# EAGLE design GDEnvSensorNode_1_4d (EAGLE 9.0.1)
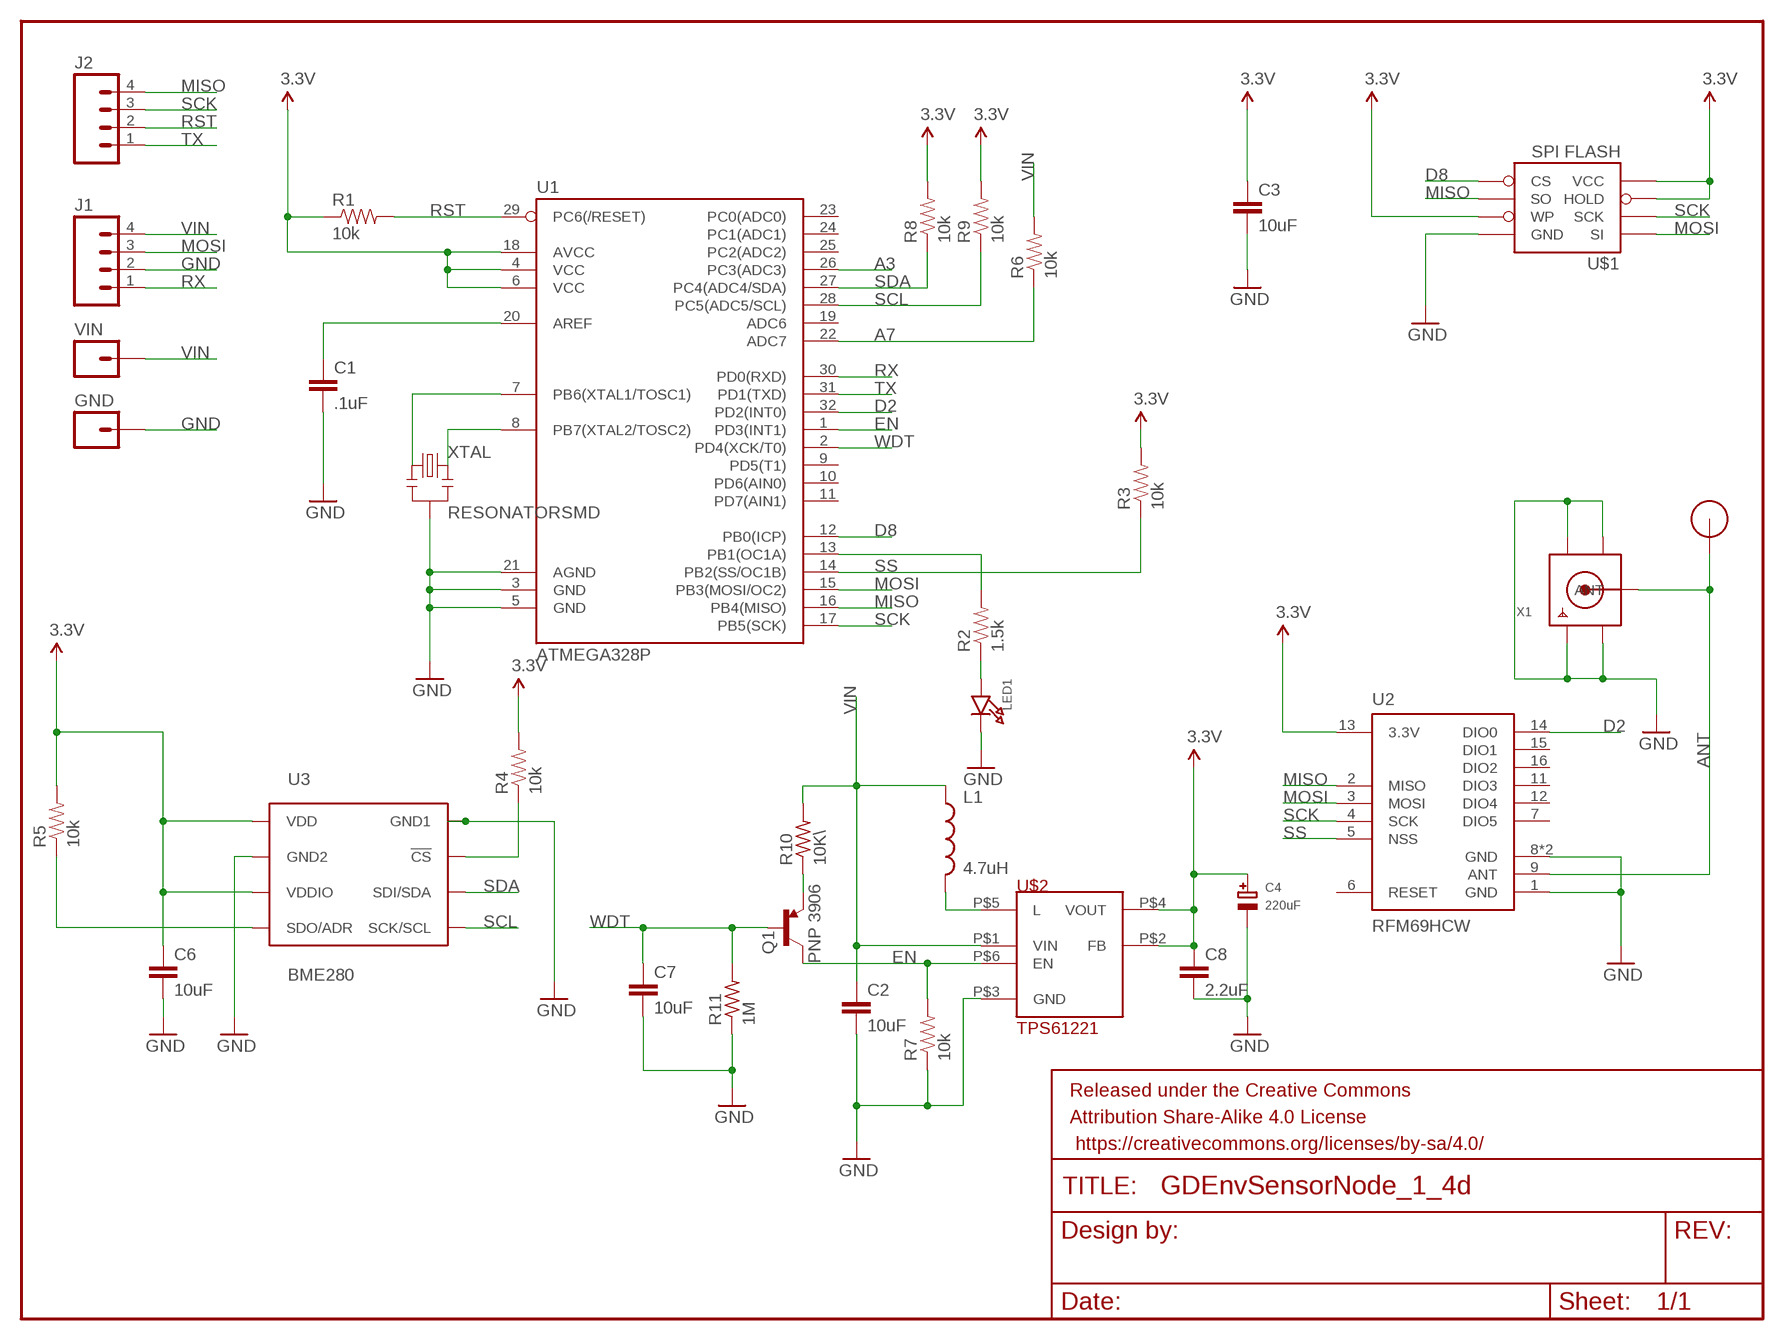
[diagram p0: schematic, sheet 1]

## Parts
C1  .1uF  CAP0805  [0805]
C2  10uF  CAP0805  [0805]
C3  10uF  CAP0805  [0805]
C4  220uF  CAP_TANTALUMB/3528_REFLOW  [EIA3528-21/B-R]
C6  10uF  CAP0805  [0805]
C7  10uF  CAP0805  [0805]
C8  2.2uF  CAP0805  [0805]
FRAME1  FRAME-LETTER  [CREATIVE_COMMONS]
GND  M01PTH_2MM  [1X01_2MM]
J1  M04PTH  [1X04]
J2  M04PTH  [1X04]
L1  4.7uH  INDUCTOR1210  [1210]
LED1  LED0805  [CHIPLED_0805]
Q1  PNP 3906  TRANSISTOR_PNPPMBT3906  [SOT23-3]
R1  10k  RESISTOR0805-RES  [0805]
R2  1.5k  RESISTOR0805-RES  [0805]
R3  10k  RESISTOR0805-RES  [0805]
R4  10k  RESISTOR0805-RES  [0805]
R5  10k  RESISTOR0805-RES  [0805]
R6  10k  RESISTOR0805-RES  [0805]
R7  10k  RESISTOR0805-RES  [0805]
R8  10k  RESISTOR0805-RES  [0805]
R9  10k  RESISTOR0805-RES  [0805]
R10  10K\  R-US_R0805  [R0805]
R11  1M  R-US_R0805  [R0805]
U1  ATMEGA328P  ATMEGA328P_TQFP  [TQFP32-08]
U2  RFM69HCW  [RFM69HCW-XXXS2]
U3  BME280  [BME280_LGA]
U$1  SPI FLASH  AT25F512BJEDEC_3.9MM  [SO08]
U$2  TPS61221  [TPS61221]
U$4  RFM12B_ANTENNA  [RFM12B-ANTENNA]
VIN  M01PTH_2MM  [1X01_2MM]
X1  SMACONNECTOR_EDGE_UFL  [SMA_EDGELAUNCH_UFL]
XTAL  RESONATORSMD  [RESONATOR-SMD]

## Nets
3.3V: C3.1 C4.+ C6.1 C8.1 R1.1 R3.2 R4.2 R5.2 R8.2 R9.2 U1.4(VCC) U1.6(VCC) U1.18(AVCC) U2.13(3.3V) U3.P$6(VDDIO) U3.P$8(VDD) U$1.3_WP(WP) U$1.7_HOLD(HOLD) U$1.8_VCC(VCC) U$2.P$2(FB) U$2.P$4(VOUT)
A3: U1.26(PC3(ADC3))
A7: R6.1 U1.22(ADC7)
ANT: U2.9(ANT) U$4.P$1 X1.P(ANT)
D2: U1.32(PD2(INT0)) U2.14(DIO0)
D8: U1.12(PB0(ICP)) U$1.1_CS(CS)
EN: Q1.3(C) R7.2 U1.1(PD3(INT1)) U$2.P$6(EN)
GND: C1.2 C2.2 C3.2 C4.- C6.2 C7.2 C8.2 GND.1 J1.2 LED1.C R7.1 R11.1 U1.3(GND) U1.5(GND) U1.21(AGND) U2.1(GND) U2.8(GND) U2.10(GND) U3.P$1(GND1) U3.P$7(GND2) U$1.4_GND(GND) U$2.P$3(GND) X1.GND@1(GND1) X1.GND@2(GND2) X1.GND@3(GND3) X1.GND@4(GND4) XTAL.2
L: L1.2 U$2.P$5(L)
MISO: J2.4 U1.16(PB4(MISO)) U2.2(MISO) U$1.2_SO(SO)
MOSI: J1.3 U1.15(PB3(MOSI/OC2)) U2.3(MOSI) U$1.5_SI(SI)
N$1: U1.8(PB7(XTAL2/TOSC2)) XTAL.3
N$2: U1.7(PB6(XTAL1/TOSC1)) XTAL.1
N$3: LED1.A R2.1
N$4: Q1.2(E) R10.1
N$5: R4.1 U3.P$2(!CS)
N$8: R2.2 U1.13(PB1(OC1A))
N$13: C1.1 U1.20(AREF)
N$17: R5.1 U3.P$5(SDO/ADR)
RST: J2.2 R1.2 U1.29(PC6(/RESET))
RX: J1.1 U1.30(PD0(RXD))
SCK: J2.3 U1.17(PB5(SCK)) U2.4(SCK) U$1.6_SCK(SCK)
SCL: R9.1 U1.28(PC5(ADC5/SCL)) U3.P$4(SCK/SCL)
SDA: R8.1 U1.27(PC4(ADC4/SDA)) U3.P$3(SDI/SDA)
SS: R3.1 U1.14(PB2(SS/OC1B)) U2.5(NSS)
TX: J2.1 U1.31(PD1(TXD))
VIN: C2.1 J1.4 L1.1 R6.2 R10.2 U$2.P$1(VIN) VIN.1
WDT: C7.1 Q1.1(B) R11.2 U1.2(PD4(XCK/T0))
Unconnected: U1.9(PD5(T1)) U1.10(PD6(AIN0)) U1.11(PD7(AIN1)) U1.19(ADC6) U1.23(PC0(ADC0)) U1.24(PC1(ADC1)) U1.25(PC2(ADC2)) U2.6(RESET) U2.7(DIO5) U2.11(DIO3) U2.12(DIO4) U2.15(DIO1) U2.16(DIO2)

## Library data of the parts
C1-C3 C6-C8 = SparkFun-Capacitors:CAP: Capacitor Standard 0603 ceramic capacitor, and 0.1" leaded capacitor.
C4 = microbuilder:CAP_TANTALUM: Tantalum Capacitors Wave footprints have larger pads and are meant to be used for hand soldering. Reflow footprints are optimised for solder paste and a reflow oven. EIA3216-18/A-[R/W] - Size A / 3216-18 / 1206 footprint 4.7µF 25V 10% Tantalum Capacitor 10µF 16V 10% Tantalum Capacitor [Digikey: 495-2236-2-ND] EIA3528-21/B-[R/W] - Size B / 3528-21 47µF 10V 10% Tantalum Capactior [Digikey: 495-2216-1-ND] EIA6032-28/C-[R/W] - Size C / 6032-28 10µF 35V 20% Tantalum Capacitor [Digikey: 495-2285-1-ND] 100µF 16V 10% Tantalum Capactior [Digikey: 399-5214-1-ND]
FRAME1 = SparkFun-Aesthetics:FRAME-LETTER: Schematic Frame Standard 8.5x11 US Letter frame
GND VIN = SparkFun-Connectors:M01: Header 1 Standard 1-pin 0.1" header. Use with straight break away headers (SKU : PRT-00116), right angle break away headers (PRT-00553), swiss pins (PRT-00743), machine pins (PRT-00117), and female headers (PRT-00115). SMTSO-256-ET is a "flush mount" nut for a 4-40 screw. The older package used to be too tight, and did not allow it to sit properly thru the drill hit. The latest (0.165DIA) fits nice and snug.
J1 J2 = SparkFun-Connectors:M04: Header 4 Standard 4-pin 0.1" header. Use with straight break away headers (SKU : PRT-00116), right angle break away headers (PRT-00553), swiss pins (PRT-00743), machine pins (PRT-00117), and female headers (PRT-00115). Molex polarized connector foot print use with SKU : PRT-08231 with associated crimp pins and housings. 1MM SMD Version SKU: PRT-10208; PROD_ID: CONN-09696
L1 = SparkFun-Passives:INDUCTOR: Inductors Basic Inductor/Choke - 0603 and 1206. Footprints are not proven and vary greatly between part numbers. INDUCTOR POWER 3.3UH 4.0A SMD 0.197" L x 0.197" W x 0.177" H (5.00mm x 5.00mm x 4.50mm)
LED1 = microbuilder:LED: LED 0603 - 0603 Surface Mount Package 2mA: Green LED - Low Power (3.9mcd, 2ma, 1.7Vf) - Digikey: 475-2709-2-ND Orange LED - Low Power (9.8mcd, 2ma, 1.8Vf) - Digikey: 475-1194-2-ND Red LED - Low Power (5mcd, 2ma, 1.8Vf) - Digikey: 475-1195-2-ND Yellow LED - Low Power (7mcd, 2ma, 1.8Vf) - Digikey: 475-1196-2-ND 5mA: Blue LED - Low Power (17mcd, 5ma, 2.9Vf) - Digikey: LNJ937W8CRACT-ND 0805 - 0805 Surface Mount Package 2mA: Red LED (8.8mcd, 2mA, 1.8Vf, Clear) - Low Power [Digikey: 475-2510-1-ND] Green LED (5mcd, 2mA, 1.8Vf, Clear) - Low Power [Digikey: 475-2730-1-ND] Yellow LED (11.3mcd, 2mA, 1.8Vf, Clear) - Low Power [Digikey: 475-2555-1-ND] 20mA: Red LED (104mcd, 20mA, Diffused) - LS R976 [Digikey: 475-1278-6-ND] Red LED (12mcd, 20mA, 2.0Vf, Clear) - APT2012EC [Digikey: 754-1128-1-ND] Green LED (15mcd, 20mA, 2.2Vf, Clear) - APT2012GC [Digikey: 754-1131-1-ND] Orange LED (160mcd, 20mA, 2.1Vf, Clear) - APT2012SECK [Digikey: 754-1130-1-ND] 1206 - 1206 Surface Mount Package Green LED (26mcd, 20mA, Diffused) - LG N971 [Digikey: 475-1407-6-ND] Red LED (15mcd, 20mA, Diffused) - LH N974 [Digikey: 475-1416-6-ND]
Q1 = SparkFun-DiscreteSemi:TRANSISTOR_PNP: Generic PNP BJT Double check pinouts against datasheets- not all devices are the same! MMBT3906 - 40V 200mA SOT-23 (TRANS-08052) MMBT4403 - 40V 600mA SOT-23 (TRANS-09245); PROD_ID: TRANS-08052; VALUE: PMBT3906
R1-R9 = SparkFun-Passives:RESISTOR: Resistor Basic schematic elements and footprints for 0603, 1206, and PTH resistors.
R10 R11 = adafruit:R-US_: RESISTOR, American symbol
U1 = SparkFun-DigitalIC:ATMEGA328P_TQFP; PROD_ID: IC-09069; VALUE: ATMEGA328P_TQFP
U2 = SparkFun-RF:RFM69H; PROD_ID: IC-11997, IC-12053
U3 = BME280ComponentLibrary:BME280; PROD_ID: IC-13090
U$1 = LowPowerLab:AT25F512B: 4-Mbit SPI flash memory
U$2 = GDTech:TPS61221; AVAILABILITY: Unavailable; DESCRIPTION: the tps6122x family devices provide a power-supply solution for products powered by either a single-cell two-cell or ...; MF: Texas Instruments; MP: TPS61221; PACKAGE: SC-70 Texas Instruments; PRICE: None
U$4 = LowPowerLab:RFM12B_ANTENNA
X1 = adafruit:SMACONNECTOR: SMA Connector 90° DIP SMA Connector, 50 Ohm (4UConnector: 07259)
XTAL = GDTech:RESONATOR: Resonator Small SMD resonator. This is the itty bitty 10/20MHz resonators with built in caps. CSTCE10M0G55 and CSTCE20M0V53. Footprint has been reviewed closely but hasn't been tested yet.

## Board
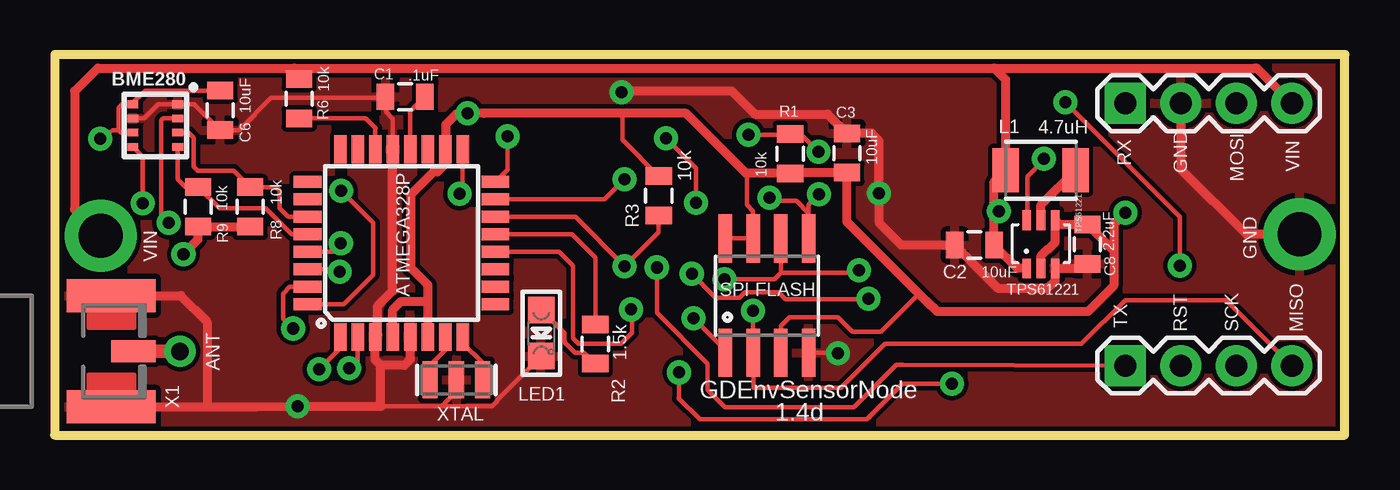
[diagram p1: board, top side]
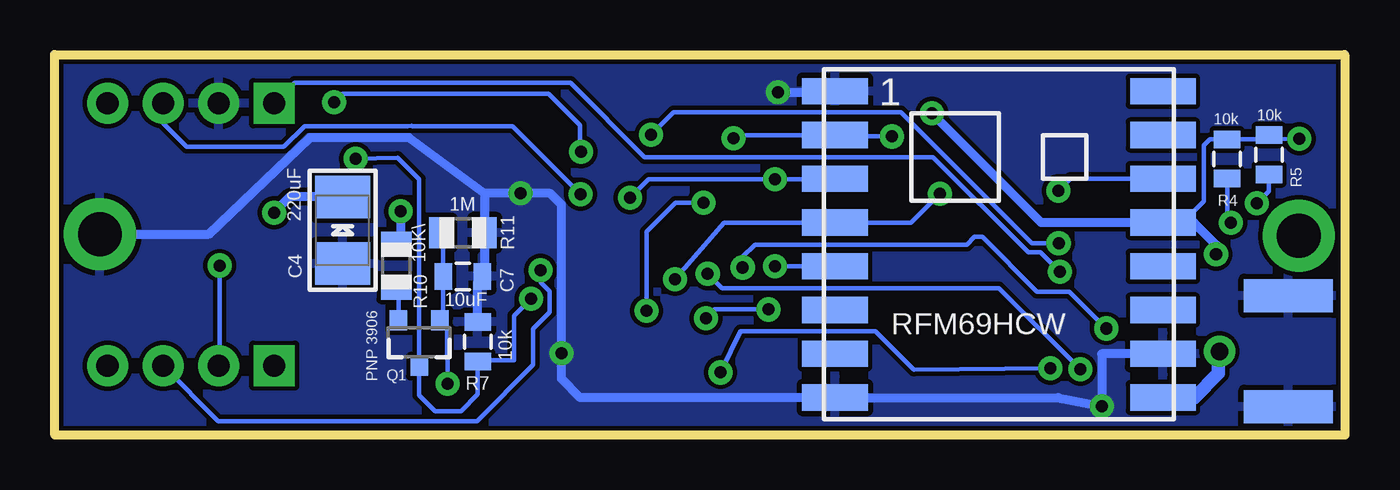
[diagram p2: board, bottom side, seen from below]

Size 59.01 x 17.4 mm. Coordinates in mm from the lower left corner, seen from the top.
Outline: 0,0 59,0 59.01,17.4 0.01,17.4 0,0
Copper layers (1*16): Top 0.035mm / dielectric 1.5mm / Bottom 0.035mm
Design rules "SparkFun *": minimum track width 8mil, minimum drill 20mil, track to track 8mil, track to pad 8mil, pad to pad 8mil, via to via 8mil, smd to smd 8mil, copper to edge 8mil, drill to drill 8mil, minimum pad ring 12mil, minimum via ring 10mil, stop-mask expansion 4mil, vias tented up to drill 22mil, thermal gap 10mil

### Footprints (pad centres in the part's own frame; a part is rotated, then mirrored left to right if it is on the bottom)
0805 = smd 0.8 x 1.2: 1 -0.9,0; 2 0.9,0
EIA3528-21/B-R = smd 1.95 x 2.5: + 1.525,0; - -1.525,0
1X01_2MM = drill 2 pad 3.302: 1 0,0
1X04 = drill 1.016 pad 1.88 square: 1 0,0 | drill 1.016 pad 1.88: 2 2.54,0; 3 5.08,0; 4 7.62,0
1210 = smd 1.2 x 2: 1 -1.6,0; 2 1.6,0
CHIPLED_0805 = smd 1.2 x 1.2: A 0,-1.05; C 0,1.05
SOT23-3 = smd 0.8 x 0.9: 1 -0.95,-1; 2 0.95,-1; 3 0,1.1
R0805 = smd 1.1 x 1.4: 1 -1,0; 2 1,0
TQFP32-08 = smd 1.27 x 0.559: 1 -4.293,2.8; 2 -4.293,2; 3 -4.293,1.2; 4 -4.293,0.4; 5 -4.293,-0.4; 6 -4.293,-1.2; 7 -4.293,-2; 8 -4.293,-2.8; 17 4.293,-2.8; 18 4.293,-2; 19 4.293,-1.2; 20 4.293,-0.4; 21 4.293,0.4; 22 4.293,1.2; 23 4.293,2; 24 4.293,2.8 | smd 0.559 x 1.27: 9 -2.8,-4.293; 10 -2,-4.293; 11 -1.2,-4.293; 12 -0.4,-4.293; 13 0.4,-4.293; 14 1.2,-4.293; 15 2,-4.293; 16 2.8,-4.293; 25 2.8,4.293; 26 2,4.293; 27 1.2,4.293; 28 0.4,4.293; 29 -0.4,4.293; 30 -1.2,4.293; 31 -2,4.293; 32 -2.8,4.293
RFM69HCW-XXXS2 = smd 3 x 1.2: 1 -7.5,7; 2 -7.5,5; 3 -7.5,3; 4 -7.5,1; 5 -7.5,-1; 6 -7.5,-3; 7 -7.5,-5; 8 -7.5,-7; 9 7.5,-7; 10 7.5,-5; 11 7.5,-3; 12 7.5,-1; 13 7.5,1; 14 7.5,3; 15 7.5,5; 16 7.5,7
BME280_LGA = smd 0.5 x 0.35: P$1 1.025,0.975; P$2 1.025,0.325; P$3 1.025,-0.325; P$4 1.025,-0.975; P$5 -1.025,-0.975; P$6 -1.025,-0.325; P$7 -1.025,0.325; P$8 -1.025,0.975
SO08 = smd 0.61 x 2.21: 1_CS -1.905,-2.616; 2_SO -0.635,-2.616; 3_WP 0.635,-2.616; 4_GND 1.905,-2.616; 5_SI 1.905,2.616; 6_SCK 0.635,2.616; 7_HOLD -0.635,2.616; 8_VCC -1.905,2.616
TPS61221 = smd 0.9 x 0.4: P$1 0,0; P$2 0,-0.65; P$3 0,-1.3; P$4 2.2,-1.3; P$5 2.2,-0.65; P$6 2.2,0
RFM12B-ANTENNA = drill 0.8 pad 1.422: P$1 0,0
SMA_EDGELAUNCH_UFL = smd 4.064 x 1.524: GND@1 2.032,-2.54; GND@2 2.032,2.54 | smd 4.064 x 1.524 bottom: GND@3 2.032,2.54; GND@4 2.032,-2.54 | smd 2.032 x 1.016: P 3.048,0
RESONATOR-SMD = smd 0.7 x 1.7: 1 -1.2,0; 2 0,0; 3 1.2,0

### Placement (x,y rotation side)
C1  16.04,15.48 180 top
C2  42.06,8.7 180 top
C3  36.23,12.9 90 top
C4  45.84,9.37 90 bottom
C6  7.57,14.86 270 top
C7  40.34,7.26 0 bottom
C8  47.23,8.74 270 top
FRAME1  21.56,-9.71 0 top  (outside the outline)
GND  56.94,9.19 0 top
J1  48.97,15.18 0 top
J2  48.97,3.18 0 top
L1  45.1,12.12 0 top
LED1  22.26,4.67 180 top
Q1  42.34,4.26 180 bottom
R1  33.64,12.87 90 top
R2  24.73,4.17 90 top
R3  27.63,10.95 90 top
R4  5.38,12.63 90 bottom
R5  3.47,12.82 90 bottom
R6  11.18,15.39 90 top
R7  39.66,4.28 270 bottom
R8  8.94,10.44 270 top
R9  6.56,10.45 270 top
R10  43.38,7.75 90 bottom
R11  40.34,9.26 180 bottom
U1  15.87,8.79 90 top
U2  15.82,8.72 0 bottom
U3  4.6,14.16 0 top
U$1  32.58,6.38 0 top
U$2  44.46,7.63 90 top
U$4  5.73,3.84 270 top
VIN  2.11,9.12 0 top
X1  0.55,3.84 0 top
XTAL  18.37,2.53 0 top

### Tracks (layer width: path | path; a pad name or v marks a point on that pad's centre or on a via)
3.3V  (via drill 0.55 pad 1.1)
  Top 0.203: U3.P$8 3.51,15.13 | 3.51,15.13 3.09,15.13 2.93,14.98 2.93,13.95 | 2.93,13.95 3.05,13.83 3.06,13.83 U3.P$6 | C6.1 4.13,15.76 3.51,15.13 | v2.09,13.55 2.65,13.95 2.93,13.95 | U$1.8_VCC U$1.7_HOLD | U$1.7_HOLD 31.97,9.03 | R3.2 25.97,13.51 25.97,14.72 | U$1.7_HOLD 31.95,10.24 31.66,10.53 31.66,11.94 31.62,11.97 | U$1.3_WP 33.21,5.01 33.6,5.4 35.82,5.4 36.48,4.74 37.79,4.74 39.52,6.47
  Top 0.406: U$2.P$2 45.11,8.21 45.39,8.49 45.42,8.49 45.76,8.83 U$2.P$4 45.95,9.64 C8.1 48.44,8.43 | 48.44,8.43 48.44,6.84 47.25,5.65 40.37,5.65 39.9,6.11 | 39.9,6.11 39.52,6.47 | 19.64,14.72 v18.88,14.72 | v18.88,14.72 18.41,14.72 17.89,14.2 17.89,13.1 U1.18 17.86,12.39 17.51,12.04 17.33,12.04 16.28,10.99 16.28,7.65 17.06,6.87 17.06,6.09 | 17.06,6.09 U1.6 | U1.4 15.46,5.73 15.85,6.12 17.03,6.12 17.06,6.09 | v18.88,14.72 25.97,14.72 28.88,14.72 31.62,11.97 R1.1 33.67,12 C3.1 36.23,9.77 39.9,6.11 | v48.97,10.18 48.44,9.65 48.44,8.43 | v5.89,8.28 6.56,8.95 R9.2 R8.2
  Bottom 0.203: U2.13 7.43,9.72 6.46,10.7 6.46,13.25 6.18,13.53 R4.2 3.48,13.53 | 3.48,13.53 R5.2 | 3.48,13.53 v2.09,13.55
  Bottom 0.406: 46.05,10.92 C4.+ 48.25,10.89 v48.97,10.18 | v18.88,14.72 13.88,9.72 U2.13 6.9,9.72 5.87,8.69 5.87,8.3 v5.89,8.28
A7
  Top 0.203: R6.1 14.22,14.49 14.67,14.04 U1.22
ANT
  Top 0.61: X1.P U$4.P$1
  Bottom 0.61: U2.9 6.89,1.73 5.78,2.84 5.78,3.79 U$4.P$1
D2  (via drill 0.55 pad 1.1)
  Top 0.203: v13.11,11.18 14.57,9.72 14.57,7.33 13.22,5.98 U1.32
  Bottom 0.203: U2.14 12.57,11.72 v13.11,11.18
D8  (via drill 0.55 pad 1.1)
  Top 0.203: U1.12 23.07,8.38 23.72,7.74 23.72,4.43 23.97,4.18 25.91,4.18 26.41,4.68 26.41,5.7 v26.36,5.75 | v29.22,5.35 30.67,3.9 U$1.1_CS
  Bottom 0.203: v26.36,5.75 28.82,5.75 v29.22,5.35
EN  (via drill 0.55 pad 1.1)
  Top 0.203: v45.24,12.64 45.23,12.57 44.48,11.82 44.48,9.85 U$2.P$6 | U1.1 13.07,3.98 v12.1,3.01 | v29.14,7.38 30.15,6.36 | 30.15,6.36 30.28,6.24 | 30.15,6.36 30.2,6.36 30.29,6.28 31.31,6.28 31.58,6.54 33.1,6.54 33.42,6.22 37.21,6.22 v37.23,6.24
  Bottom 0.203: 39.49,3.38 R7.2 | R7.2 39.66,1.87 40.43,1.1 41.61,1.1 42.34,1.83 Q1.3 42.34,11.7 43.32,12.68 v45.24,12.64 | v12.1,3.01 15.81,6.73 28.49,6.73 v29.14,7.38 | v37.23,6.24 38,5.47 38,3.44 39.6,3.44 R7.2
GND  (via drill 0.55 pad 1.1)
  Top 0.203: U3.P$7 4.09,14.48 4.74,15.13 U3.P$1 6.39,15.13 C6.2 8.45,13.96 9.91,15.42 15.12,15.42 15.16,15.45 | XTAL.2 18.37,2.01 17.69,1.33 | 17.69,1.33 15.61,1.33 14.91,1.32 | U1.21 15.46,14.47 15.16,14.78 15.16,15.45 | 15.16,15.45 C1.2 | LED1.C 20.23,1.59 20.23,1.56 20,1.33 17.69,1.33 | U$1.4_GND 35.81,3.77 v35.83,3.75
  Top 0.406: C8.2 47.02,7.63 U$2.P$3 45.76,7.05 45.41,6.71 43.15,6.71 C2.2 38.73,8.7 37.73,9.69 37.73,11.03 v37.7,11.06 37.7,13.47 37.36,13.81 36.24,13.81 C3.2 35.35,14.69 32.02,14.69 30.99,15.72 25.95,15.72 v25.92,15.69 | GND.1 54.5,9.19 51.54,12.15 51.54,15.15 J1.2 | U1.5 16.27,3.47 16,3.2 14.91,3.2 | 14.91,3.2 14.66,3.45 14.67,3.46 U1.3 14.78,4.61 14.78,5.91 15.46,6.6 U1.21 | 14.91,3.2 14.9,3.19 14.91,1.32 v11.12,1.32 9.2,1.3 6.97,1.3 | X1.GND@1 6.97,1.3 | X1.GND@2 5.77,6.38 6.97,5.18 6.97,1.3
  Bottom 0.406: R7.1 39.66,7.04 C7.2 39.34,7.36 R11.1 39.34,11.06 | U2.10 11.12,3.73 v11.12,1.32 13.12,1.73 U2.8 34.97,1.73 35.83,2.58 v35.83,3.75 35.83,10.54 36.35,11.06 v37.7,11.06 39.34,11.06 | GND.1 51.96,9.19 47.33,13.62 42.82,13.62 39.34,11.06 | v25.92,15.69 23.36,15.69 U2.1
  pour Bottom: 0.06,17.44 59.06,17.44 59,0 0,0
  pour Top: 0.06,17.42 59.06,17.42 59.03,0.02 0.03,0.02
L
  Top 0.406: U$2.P$5 45.11,10.53 L1.2
MISO  (via drill 0.55 pad 1.1)
  Top 0.203: U1.16 20.72,12.15 v20.72,13.66 | v27.97,13.57 29.34,12.21 v29.34,10.62 | v31.93,5.68 31.93,3.78 U$1.2_SO 31.97,3.74 31.97,2.18 35.97,2.18 37.97,4.18 46.97,4.18 48.97,6.18 53.59,6.18 J2.4
  Bottom 0.203: v20.72,13.66 23.25,13.66 U2.2 27.82,13.72 v27.97,13.57 | v29.34,10.62 30.62,10.62 31.93,9.31 v31.93,5.68
MOSI  (via drill 0.55 pad 1.1)
  Top 0.203: U1.15 25.15,10.79 v26.07,11.7 | v32.69,10.86 32.84,10.71 33.93,10.71 34.48,10.15 U$1.5_SI 34.48,10.55 v34.96,11.03
  Bottom 0.203: U2.3 23.34,11.7 v26.07,11.7 31.85,11.7 v32.69,10.86 | v34.96,11.03 38.06,14.13 42.65,14.13 42.69,14.15 42.86,14.13 47.32,14.13 47.53,14.13 47.58,14.13 48.53,13.18 52.97,13.18 54.05,14.26 J1.3
N$1
  Top 0.203: U1.8 18.66,4.21 19.57,3.31 XTAL.3
N$2
  Top 0.203: U1.7 17.86,3.9 17.17,3.2 XTAL.1
N$3
  Top 0.203: R2.1 24.71,3.27 24.21,3.77 23.8,3.77 23.31,4.26 23.31,4.67 LED1.A
N$4
  Bottom 0.203: Q1.2 43.29,6.66 R10.1
N$5  (via drill 0.55 pad 1.1)
  Top 0.203: v5.21,9.72 4.88,10.05 4.88,14.41 4.96,14.49 4.96,14.48 U3.P$2
  Bottom 0.203: R4.1 5.38,9.9 v5.21,9.72
N$8
  Top 0.203: U1.13 23.67,9.19 24.74,8.12 24.73,8.11 R2.2
N$13
  Top 0.203: U1.20 16.27,14.81 C1.1
N$17  (via drill 0.55 pad 1.1)
  Top 0.203: v4.02,10.61 4.02,12.74 U3.P$5
  Bottom 0.203: R5.1 3.48,11.15 v4.02,10.61
RST  (via drill 0.55 pad 1.1)
  Top 0.203: U1.29 12.71,8.38 v13.09,8.77 | v31.73,13.73 33.32,13.73 R1.2 34.24,13.64 v34.93,12.96 | v46.22,15.23 51.47,9.98 v51.47,7.76
  Bottom 0.203: v13.09,8.77 14.31,8.77 20.3,14.76 30.7,14.76 v31.73,13.73 | v46.22,15.23 45.83,15.62 36.41,15.62 34.97,14.18 34.97,13 v34.93,12.96 | v51.47,7.76 51.47,3.22 J2.2
RX  (via drill 0.55 pad 1.1)
  Top 0.203: U1.30 12.92,7.58 v13.04,7.46
  Bottom 0.203: v13.04,7.46 13.94,8.36 14.48,8.36 18.83,12.72 32.03,12.72 35.42,16.11 48.04,16.11 J1.1
SCK  (via drill 0.55 pad 1.1)
  Top 0.203: U1.17 18.66,11.2 v18.52,11.05 | v30.64,7.13 32.93,7.14 33.21,7.42 | 33.21,7.42 U$1.6_SCK | 33.21,7.42 36.67,7.42 v36.79,7.54
  Bottom 0.203: v18.52,11.05 19.84,9.72 U2.4 28.39,9.72 v30.64,7.13 | v36.79,7.54 36.79,7 36.38,6.59 36.38,5.63 37.13,4.88 37.13,3.22 39.7,0.65 51.52,0.65 J2.3
SCL
  Top 0.203: U3.P$4 5.63,11.7 5.99,11.34 6,11.35 R9.1 7.54,10.37 9.66,10.37 10.85,9.19 U1.28
SDA
  Top 0.203: U3.P$3 6.12,13.83 6.35,13.61 6.35,12.28 6.53,12.1 8.18,12.1 8.87,11.41 R8.1 10.14,11.34 10.29,11.19 10.29,10.37 10.68,9.98 U1.27
SS  (via drill 0.55 pad 1.1)
  Top 0.203: U1.14 23.81,9.98 v26.07,7.73 27.63,9.29 R3.1
  Bottom 0.203: v26.07,7.73 v26.06,7.72 U2.5
TX  (via drill 0.55 pad 1.1)
  Top 0.203: U1.31 10.76,6.79 10.45,6.48 10.45,5.33 v10.9,4.88 | v27.54,7.67 27.54,5.6 29.86,3.28 29.86,2.08 30.66,1.28 36.56,1.28 38.51,3.23 38.79,3.23 J2.1
  Bottom 0.203: v10.9,4.88 12.59,6.57 14.08,6.57 16.58,9.07 16.94,9.07 17.29,8.72 26.97,8.72 27.54,8.15 v27.54,7.67
VIN  (via drill 0.55 pad 1.1)
  Top 0.203: J1.4 54.88,16.89
  Top 0.406: 42.96,10.18 C2.1 44.03,7.63 U$2.P$1 | 42.96,10.18 42.96,11.58 L1.1 43.5,16.26 42.97,16.79 | J1.4 54.98,16.79 42.97,16.79 | 10.97,16.79 1.97,16.79 0.91,15.73 0.91,10.32 VIN.1 | 10.97,16.79 42.97,16.79 | R6.2 11.18,16.58 10.97,16.79 | 42.96,10.18 43.03,10.25 v43.2,10.25
  Bottom 0.406: v43.2,10.25 43.2,8.94 R10.2
WDT  (via drill 0.55 pad 1.1)
  Top 0.203: U1.2 13.87,3.3 v13.46,3.07 | v41.04,2.35 38.78,2.35 37.16,0.72 | 37.3,0.86 37.16,0.72 | v28.55,2.87 28.55,1.7 28.54,1.69 29.51,0.72 36.97,0.72 37.16,0.72
  Bottom 0.203: R11.2 41.24,9.16 C7.1 41.24,5.41 Q1.1 41.06,4.93 v41.04,2.35 | v13.46,3.07 19.71,3 21.46,4.75 27.65,4.75 v28.55,2.87

### Text on the board
tPlace: RX | GND | VIN | MOSI | TX | RST | SCK | MISO
tNames: GDEnvSensorNode | 1.4d